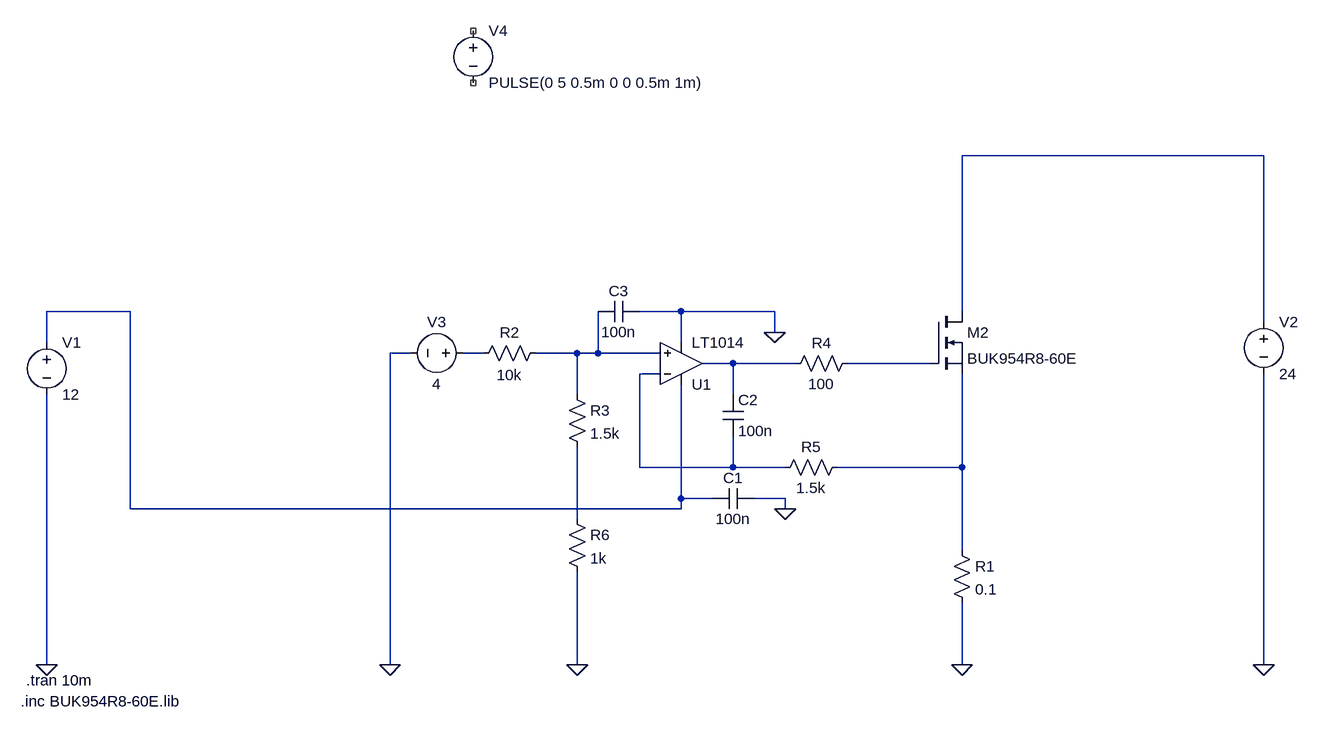
[diagram p0: schematic Spice Model - Version 2.asc]
Spice Model - Version 2.asc, the LTspice schematic file:
Version 4
SHEET 1 880 936
WIRE 672 -112 208 -112
WIRE -1072 128 -1200 128
WIRE -224 128 -288 128
WIRE -80 128 -224 128
WIRE 208 128 208 -112
WIRE 672 144 672 -112
WIRE -80 160 -80 128
WIRE -1200 176 -1200 128
WIRE -224 176 -224 128
WIRE -640 192 -672 192
WIRE -528 192 -560 192
WIRE -384 192 -448 192
WIRE -352 192 -352 128
WIRE -352 192 -384 192
WIRE -256 192 -352 192
WIRE -144 208 -192 208
WIRE -48 208 -144 208
WIRE 160 208 32 208
WIRE -256 224 -288 224
WIRE -384 256 -384 192
WIRE -144 256 -144 208
WIRE -288 368 -288 224
WIRE -144 368 -144 320
WIRE -144 368 -288 368
WIRE -64 368 -144 368
WIRE 208 368 208 224
WIRE 208 368 16 368
WIRE -224 416 -224 240
WIRE -176 416 -224 416
WIRE -64 416 -112 416
WIRE -1072 432 -1072 128
WIRE -224 432 -224 416
WIRE -224 432 -1072 432
WIRE -64 432 -64 416
WIRE -384 448 -384 336
WIRE 208 496 208 368
WIRE -1200 672 -1200 256
WIRE -672 672 -672 192
WIRE -384 672 -384 528
WIRE 208 672 208 576
WIRE 672 672 672 224
FLAG -64 432 0
FLAG -1200 672 0
FLAG -672 672 0
FLAG -80 160 0
FLAG 208 672 0
FLAG 672 672 0
FLAG -384 672 0
SYMBOL voltage -1200 160 R0
WINDOW 123 0 0 Left 2
WINDOW 39 0 0 Left 2
SYMATTR InstName V1
SYMATTR Value 12
SYMBOL voltage 672 128 R0
WINDOW 123 0 0 Left 2
WINDOW 39 0 0 Left 2
SYMATTR InstName V2
SYMATTR Value 24
SYMBOL Opamps\\LT1014 -224 272 M180
SYMATTR InstName U1
SYMBOL voltage -544 192 R90
WINDOW 0 -32 56 VBottom 2
WINDOW 3 32 56 VTop 2
WINDOW 123 0 0 Left 2
WINDOW 39 0 0 Left 2
SYMATTR InstName V3
SYMATTR Value 4
SYMBOL nmos 160 128 R0
SYMATTR InstName M2
SYMATTR Value BUK954R8-60E
SYMATTR Prefix X
SYMBOL cap -112 400 R90
WINDOW 0 0 32 VBottom 2
WINDOW 3 32 32 VTop 2
SYMATTR InstName C1
SYMATTR Value 100n
SYMBOL res 192 480 R0
SYMATTR InstName R1
SYMATTR Value 0.1
SYMATTR SpiceLine tol=1
SYMBOL res -544 208 R270
WINDOW 0 32 56 VTop 2
WINDOW 3 -2 56 VBottom 2
SYMATTR InstName R2
SYMATTR Value 10k
SYMBOL res -400 240 R0
SYMATTR InstName R3
SYMATTR Value 1.5k
SYMBOL res -64 224 R270
WINDOW 0 32 56 VTop 2
WINDOW 3 0 56 VBottom 2
SYMATTR InstName R4
SYMATTR Value 100
SYMBOL res 32 352 R90
WINDOW 0 0 56 VBottom 2
WINDOW 3 32 56 VTop 2
SYMATTR InstName R5
SYMATTR Value 1.5k
SYMBOL cap -160 256 R0
SYMATTR InstName C2
SYMATTR Value 100n
SYMBOL cap -288 112 R90
WINDOW 0 0 32 VBottom 2
WINDOW 3 32 32 VTop 2
SYMATTR InstName C3
SYMATTR Value 100n
SYMBOL res -400 432 R0
SYMATTR InstName R6
SYMATTR Value 1k
SYMBOL voltage -544 -320 R0
WINDOW 123 0 0 Left 2
WINDOW 39 0 0 Left 2
SYMATTR InstName V4
SYMATTR Value PULSE(0 5 0.5m 0 0 0.5m 1m)
TEXT -1232 696 Left 2 !.tran 10m
TEXT -1240 728 Left 2 !.inc BUK954R8-60E.lib

The netlist it stands for:
* Spice Model - Version 2.asc
V1 N002 0 12
V2 N001 0 24
XU1 N004 N007 N002 0 N005 LT1014  ; pins In+ In- V+ V- OUT
V3 N003 0 4
XM2 N001 N006 N008 BUK954R8-60E  ; pins D G S
C1 0 N002 100n
R1 N008 0 0.1 tol=1
R2 N003 N004 10k
R3 N004 N009 1.5k
R4 N005 N006 100
R5 N008 N007 1.5k
C2 N005 N007 100n
C3 0 N004 100n
R6 N009 0 1k
V4 NC_01 NC_02 PULSE(0 5 0.5m 0 0 0.5m 1m)
.tran 10m
.inc BUK954R8-60E.lib
.backanno
.end